# Altium schematic sheet programmer_charger.SchDoc: Opo4
size Letter; Author: William W. Huang; Organization: Altium Limited; Address1: L3, 12a Rodborough Rd; Address2: Frenchs Forest; Address3: NSW; Address4: Australia 2086; Revision: 1
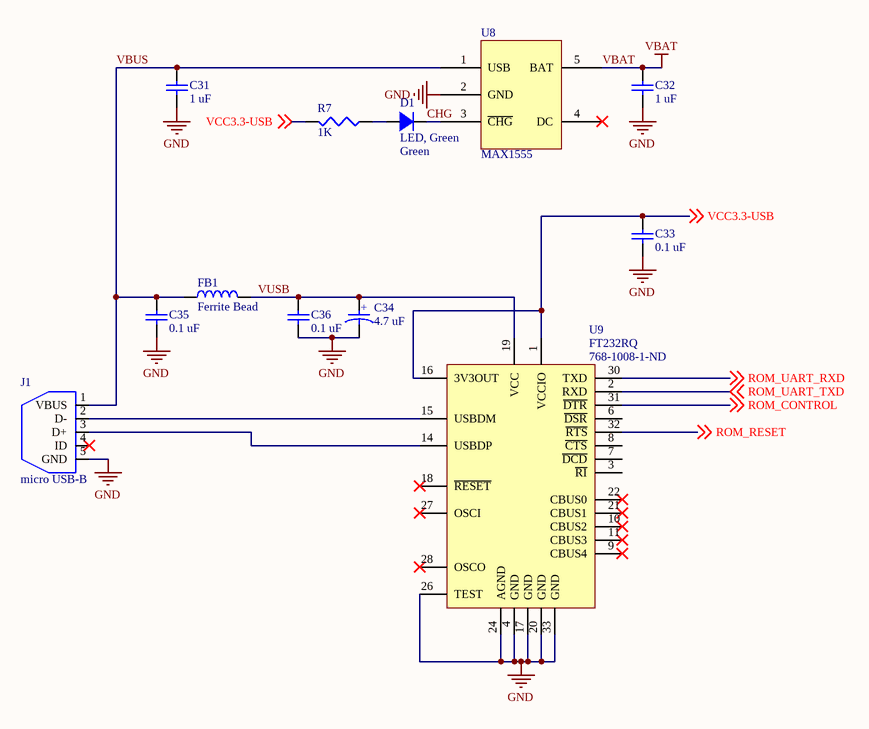
[diagram p0: programmer_charger.SchDoc]

## Parts
C31  value 1 uF  [0402]  (hidden comment: Ceramic capacitor)
C32  value 1 uF  [0402]  (hidden comment: Ceramic capacitor)
C33  value 0.1 uF  [0402]  (hidden comment: Ceramic capacitor)
C34  value 4.7 uF  [0603 - Polar Marking]  (hidden comment: Tantalum capacitor)
C35  value 0.1 uF  [0402]  (hidden comment: Ceramic capacitor)
C36  value 0.1 uF  [0402]  (hidden comment: Ceramic capacitor)
D1  LED, Green  Color: Green  [0402 - DIODE]
FB1  Ferrite Bead  [0402]
J1  micro USB-B  [Micro USB-B]
R7  value 1K  [0402]  (hidden comment: Chip resistor)
U8  MAX1555  [SOT23-5]
U9  FT232RQ  Supplier Part Number 1: 768-1008-1-ND  [QFN-32]

## Nets
GND: C31.2 C32.2 C33.2 C34.2 C35.2 C36.2 J1.5(GND) U8.2(GND) U9.4(GND) U9.17(GND) U9.20(GND) U9.24(AGND) U9.26(TEST) U9.33(GND)
VBAT: C32.1 U8.5(BAT)
CHG: D1.2 U8.3(~{CHG})
ROM_CONTROL: U9.31(~{DTR}) ; off-sheet ROM_CONTROL
ROM_RESET: U9.32(~{RTS}) ; off-sheet ROM_RESET
ROM_UART_RXD: U9.30(TXD) ; off-sheet ROM_UART_RXD
ROM_UART_TXD: U9.2(RXD) ; off-sheet ROM_UART_TXD
VBUS: C31.1 C35.1 FB1.2 J1.1(VBUS) U8.1(USB)
VCC3.3-USB: C33.1 R7.1 U9.1(VCCIO) U9.16(3V3OUT) ; off-sheet VCC3.3-USB
VUSB: C34.1 C36.1 FB1.1 U9.19(VCC)
NetD1_1: D1.1 R7.2
NetJ1_2: J1.2(D-) U9.15(USBDM)
NetJ1_3: J1.3(D+) U9.14(USBDP)

Not connected (* = marked no-connect by the designer): J1 4(ID)*; U8 4(DC)*; U9 3(~{RI}) 6(~{DSR}) 7(~{DCD}) 8(~{CTS}) 9(CBUS4)* 10(CBUS2)* 11(CBUS3)* 18(~{RESET})* 21(CBUS1)* 22(CBUS0)* 27(OSCI)* 28(OSCO)*

## Notes on the sheet
- Title
- Date:
- Author:
- Revision:
- Sheet
- of
- University of Michigan
- File:
- (in symbol C_4.7u_0603_tantalum) +

## Library data of the parts
C31 C32 = C_1u_0402_ceramic: Ceramic capacitor, 1 uF, 0402 package; Manufacture: TDK; voltage rated: 6.3 V; tolerance: 10%; package: 0402; Supplier 1: Digi-Key; Supplier Part Number 1: 445-5000-1-ND
C33 C35 C36 = C_0.1u_0402_ceramic: Ceramic capacitor, 0.1u, 0402 package; Manufacture: TDK; voltage rated: 10 V; tolerance: 10%; Supplier 1: Digi-Key; Supplier Part Number 1: 445-1265-1-ND; package: 0402
C34 = C_4.7u_0603_tantalum: Tantalum capacitor, 4.7 uF, 0603 package; Manufacture: Rohm; voltage rated: 10 V; tolerance: 20%; package: 0603; Supplier 1: Digi-Key; Supplier Part Number 1: 511-1496-1-ND
D1 = D_LED_GREEN_0402: LED, Green,  0402; package: 0402; Supplier 1: Digi-Key; Supplier Part Number 1: 511-1592-1-ND
FB1 = FB_150mA_0402: Ferrite Bead, 150 mA, 0402 package; impedance@Freq: 1K@100 MHz; current rating: 150 mA; Supplier 1: Digi-Key; Supplier Part Number 1: 587-1835-1-ND; package: 0402
J1 = Micro USB: CONN USB MICRO B RECPT SMT R/A; Supplier 1: Digi-Key; Supplier Part Number 1: 609-4616-6-ND
R7 = R_1K_0402: Chip resistor, 1K, 0402 package; tolerance: 1%; power: 1/16 W; Supplier 1: Digi-Key; Supplier Part Number 1: 541-1.00KLCT-ND; package: 0402
U8 = MAX1555: 3 Dual-Input USB/AC Adapter 1-Cell Li+  Battery Chargers; Supplier 1: Digi-Key; Supplier Part Number 1: MAX1555EZK+TTR-ND
U9 = IC_FT232RQ: FT232R USB UART; Manufacturer: *; Note: *; ManufacturerPartNo: *; Supplier 1: Digi-Key